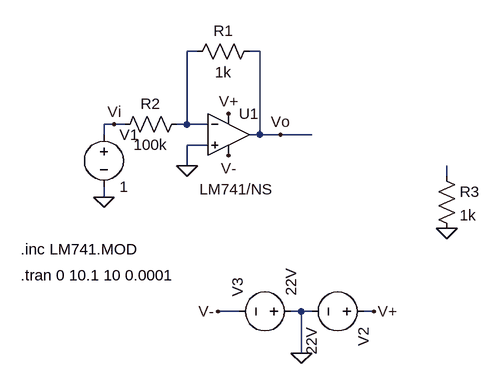
[diagram p0: schematic lm741.asc]
lm741.asc, the LTspice schematic file:
Version 4
SHEET 1 880 680
WIRE -272 -144 -288 -144
WIRE -176 -144 -192 -144
WIRE -400 -32 -416 -32
WIRE -384 -32 -400 -32
WIRE -288 -32 -288 -144
WIRE -288 -32 -304 -32
WIRE -256 -32 -288 -32
WIRE -416 -16 -416 -32
WIRE -176 -16 -176 -144
WIRE -176 -16 -192 -16
WIRE -144 -16 -176 -16
WIRE -96 -16 -144 -16
WIRE -256 0 -288 0
WIRE -288 32 -288 0
WIRE 112 48 112 32
WIRE -416 80 -416 64
WIRE -208 256 -240 256
WIRE -112 256 -128 256
WIRE -96 256 -112 256
WIRE 0 256 -16 256
WIRE -112 320 -112 256
FLAG -416 80 0
FLAG -400 -32 Vi
FLAG 0 256 V+
FLAG -240 256 V-
FLAG -112 320 0
FLAG -288 32 0
FLAG -224 -48 V+
FLAG -224 16 V-
FLAG -144 -16 Vo
FLAG 112 128 0
SYMBOL res -176 -160 R90
WINDOW 0 0 56 VBottom 2
WINDOW 3 32 56 VTop 2
SYMATTR InstName R1
SYMATTR Value 1k
SYMBOL res -288 -48 R90
WINDOW 0 0 56 VBottom 2
WINDOW 3 32 56 VTop 2
SYMATTR InstName R2
SYMATTR Value 100k
SYMBOL voltage -416 -32 R0
WINDOW 123 0 0 Left 2
WINDOW 39 0 0 Left 2
SYMATTR InstName V1
SYMATTR Value 1
SYMBOL voltage 0 256 R90
WINDOW 123 0 0 Left 2
WINDOW 39 0 0 Left 2
SYMATTR InstName V2
SYMATTR Value 22V
SYMBOL voltage -112 256 M270
WINDOW 0 23 98 Left 2
WINDOW 3 24 16 Left 2
WINDOW 123 0 0 Left 2
WINDOW 39 0 0 Left 2
SYMATTR InstName V3
SYMATTR Value 22V
SYMBOL Opamps\\opamp2 -224 -80 R0
WINDOW 3 -45 148 Left 2
SYMATTR Value LM741/NS
SYMATTR InstName U1
SYMBOL res 96 32 R0
SYMATTR InstName R3
SYMATTR Value 1k
TEXT -544 200 Left 2 !.tran 0 10.1 10 0.0001
TEXT -544 160 Left 2 !.inc LM741.MOD

The netlist it stands for:
* lm741.asc
R1 Vo N001 1k
R2 N001 Vi 100k
V1 Vi 0 1
V2 V+ 0 22V
V3 0 V- 22V
XU1 0 N001 V+ V- Vo LM741/NS  ; pins In+ In- V+ V- OUT
R3 N002 0 1k
.tran 0 10.1 10 0.0001
.inc LM741.MOD
.backanno
.end